# Altium schematic sheet Лист 3. ESP8266.SchDoc
size 420 x 297 mm; SheetNumber: 3; SheetTotal: 3
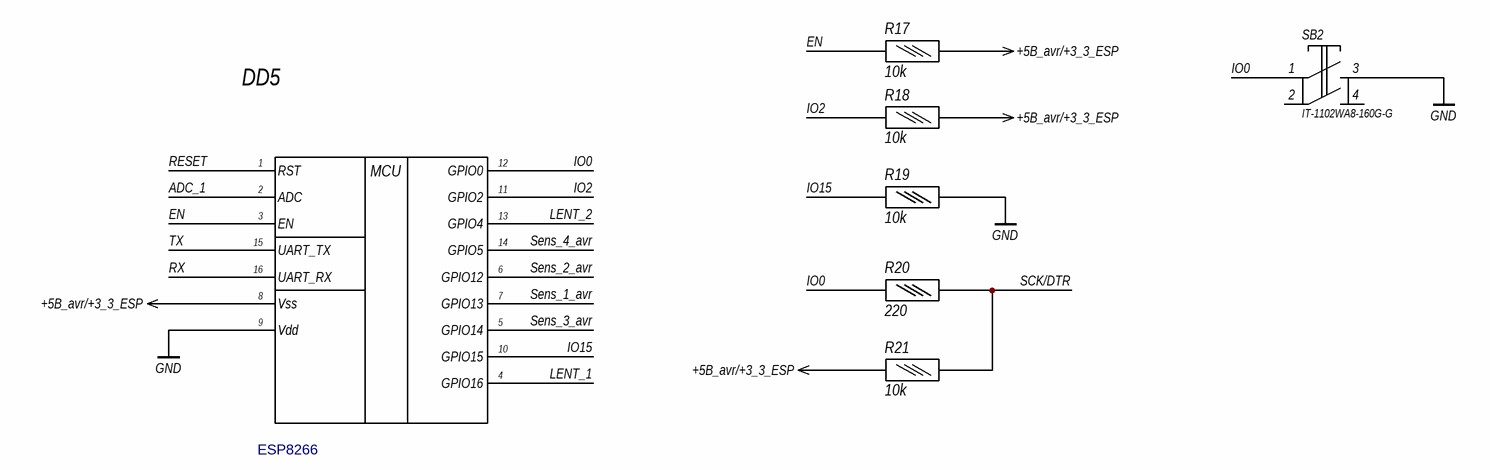
[diagram p0: Лист 3. ESP8266.SchDoc]

## Parts
DD5  ESP8266  [ESP-12F]
R17  value 10k  [RESISTOR_0603_IPC782]  (hidden comment: RC0603FR-0710KL (0603 10k 1%))
R18  value 10k  [RESISTOR_0603_IPC782]  (hidden comment: RC0603FR-0710KL (0603 10k 1%))
R19  value 10k  [RESISTOR_0603_IPC782]  (hidden comment: RC0603FR-0710KL (0603 10k 1%))
R20  value 220  [RESISTOR_0603_IPC782]  (hidden comment: RC0603FR-0710KL (0603 10k 1%))
R21  value 10k  [RESISTOR_0603_IPC782]  (hidden comment: RC0603FR-0710KL (0603 10k 1%))
SB2  value IT-1102WA8-160G-G  [TE FSM4JSMA]  (hidden comment: button IT-1102WA8-160G-G)

## Nets
+5В_avr/+3_3_ESP: DD5.8(Vss) R17.2 R18.2 R21.1
GND: DD5.9(Vdd) R19.2 SB2.3(C)
ADC_1: DD5.2(ADC)
EN: DD5.3(EN) R17.1
IO0: DD5.12(GPIO0) R20.1 SB2.1(A)
IO2: DD5.11(GPIO2) R18.1
IO15: DD5.10(GPIO15) R19.1
LENT_1: DD5.4(GPIO16)
LENT_2: DD5.13(GPIO4)
RESET: DD5.1(RST)
RX: DD5.16(UART_RX)
SCK/DTR: R20.2 R21.2
Sens_1_avr: DD5.7(GPIO13)
Sens_2_avr: DD5.6(GPIO12)
Sens_3_avr: DD5.5(GPIO14)
Sens_4_avr: DD5.14(GPIO5)
TX: DD5.15(UART_TX)

Not connected (* = marked no-connect by the designer): SB2 2(A) 4(C)

## Notes on the sheet
- Подп. и дата
- Инв. № дубл.
- Взам. инв. №
- Инв. № подл.
- Изм.
- Лист
- № докум.
- Подп.
- Дата
- Копировал
- Формат А3

## Library data of the parts
DD5 = ESP8266: MCU; Part Number: STM32F030F4P6; Manufacturer: ST Microelectronics; ValueManufacturerPartNumber: STM32F030F4P6, TSSOP-20 ST Microelectronics; ExtendedParameters: ARM® 32-bit Cortex™-M3 CPU, / frequency up to 48 Mhz16 to 64 Kbytes of Flash / 64 Kbytes of SRAM / 12-channel DMA controller / USB OTG, Ethernet, 10 timers, / 2 CANs, 2 ADCs, / 14 communication interfaces; Functionality: Микропроцессоры; TemperatureOperating_max: 85; TemperatureOperating_min: -40; FullName: Микросхема STM32F030F4P6 ST Microelectronics; ID: ESP8266; Mounting: SMT; Package: -; PackageType: TSSOP; Type: Микросхема
R17-R21 = RC0603FR-0710KL (0603 10k 1%): chip0603 10k 1%; ValueManufacturerPartNumber: chip0603 10k 1%, RC0603FR-0710KL, Yageo; Номинальное сопротивление, кОм: 10; Допуск,%: 1; Мощность, Вт: 0,1; Тип корпуса: 0603; Рабочий диапазон температур,°С: -55...+155; Производитель: Yageo; Номинальное напряжение, В: 50; Максимально допустимое напряжение, В: 100; Примечание: *; Аналог: *
SB2 = button IT-1102WA8-160G-G: IT-1102WA8-160G-G; ValueManufacturerPartNumber: IT-1102WA8-160G-G